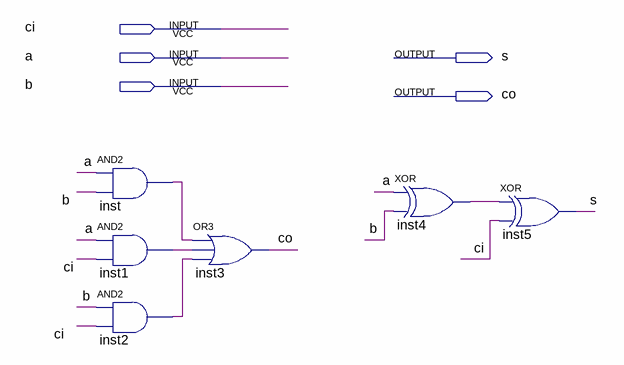
[diagram p0: schematic sheet]
// Quartus schematic sc.bdf as structural Verilog: 6 symbols, 5 pins
module sc (
  input  ci,
  input  a,
  input  b,
  output s,
  output co
);

  wire inst1_out, inst2_out, inst4_out, inst_out;

  and inst (inst_out, a, b);
  and inst1 (inst1_out, a, ci);
  and inst2 (inst2_out, b, ci);
  or inst3 (co, inst_out, inst1_out, inst2_out);
  xor inst4 (inst4_out, a, b);
  xor inst5 (s, inst4_out, ci);
endmodule
